# EAGLE schematic cell (EAGLE 6.5.0)
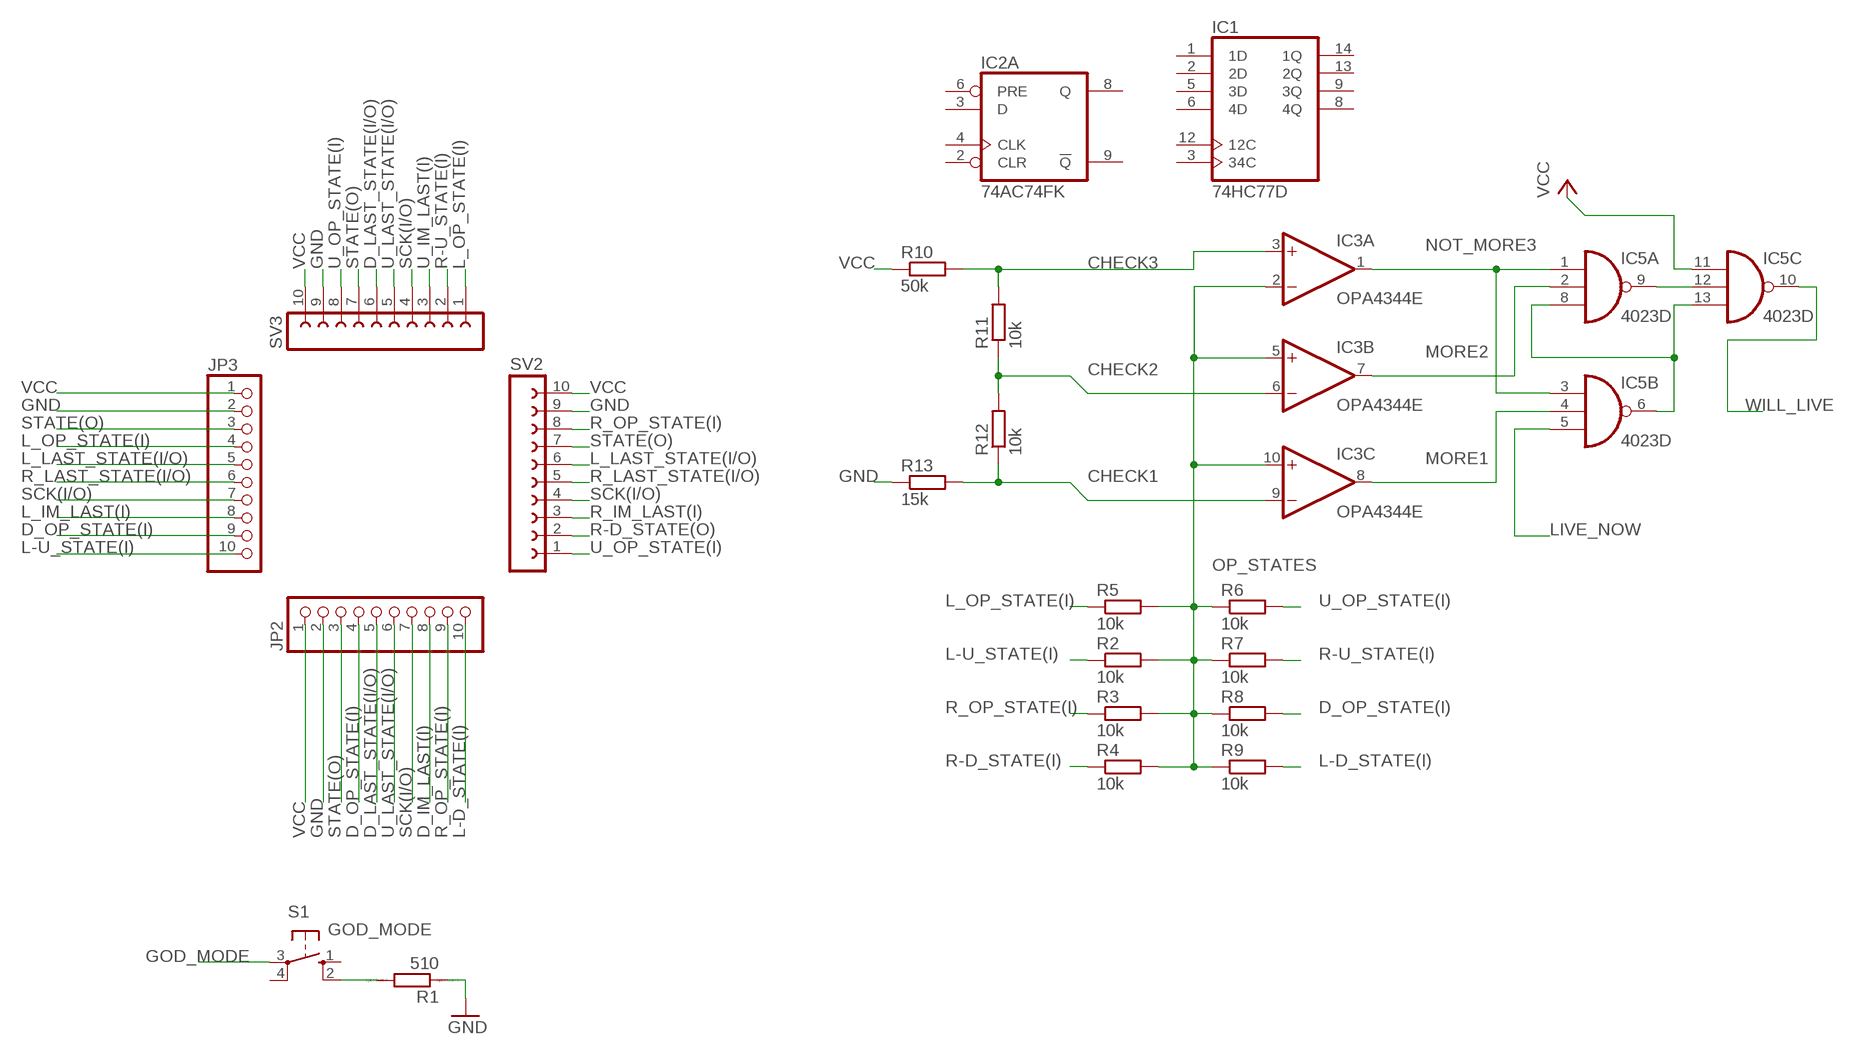
[diagram p0: schematic, sheet 1]

## Parts
IC1  74HC77D  [SO14]
IC2  74AC74FK  [LCC20]
IC3  OPA4344E  [TSSOP14]
IC5  4023D  [SO14]
JP2  PINHD-1X10  [1X10]
JP3  PINHD-1X10  [1X10]
R1  510  R  [R0805]
R2  10k  R-EU_R0805  [R0805]
R3  10k  R-EU_R0805  [R0805]
R4  10k  R-EU_R0805  [R0805]
R5  10k  R-EU_R0805  [R0805]
R6  10k  R-EU_R0805  [R0805]
R7  10k  R-EU_R0805  [R0805]
R8  10k  R-EU_R0805  [R0805]
R9  10k  R-EU_R0805  [R0805]
R10  50k  R-EU_R0805  [R0805]
R11  10k  R-EU_R0805  [R0805]
R12  10k  R-EU_R0805  [R0805]
R13  15k  R-EU_R0805  [R0805]
S1  GOD_MODE  10-XX  [B3F-10XX]
SV2  FE10W  [FE10W]
SV3  FE10W  [FE10W]

## Nets
CHECK1: IC3.9(C:-IN) R12.1 R13.2
CHECK2: IC3.6(B:-IN) R11.1 R12.2
CHECK3: IC3.3(A:+IN) R10.2 R11.2
D_IM_LAST(I): JP2.8
D_LAST_STATE(I/O): JP2.5 SV3.6
D_OP_STATE(I): JP2.4 JP3.9 R8.2
GND: JP2.2 JP3.2 R1.1 R13.1 SV2.9 SV3.9
GOD_MODE: S1.3(P)
L-D_STATE(I): JP2.10 R9.2
L-U_STATE(I): JP3.10 R2.1
L_IM_LAST(I): JP3.8
L_LAST_STATE(I/O): JP3.5 SV2.6
L_OP_STATE(I): JP3.4 R5.1 SV3.1
LIVE_NOW: IC5.5(B:I2)
MORE1: IC3.8(C:OUT) IC5.4(B:I1)
MORE2: IC3.7(B:OUT) IC5.2(A:I1)
N$1: R1.2 S1.2(S1)
N$2: IC5.6(B:O) IC5.8(A:I2) IC5.13(C:I2)
N$4: IC5.9(A:O) IC5.12(C:I1)
NOT_MORE3: IC3.1(A:OUT) IC5.1(A:I0) IC5.3(B:I0)
OP_STATES: IC3.2(A:-IN) IC3.5(B:+IN) IC3.10(C:+IN) R2.2 R3.2 R4.2 R5.2 R6.1 R7.1 R8.1 R9.1
R-D_STATE(I): R4.1
R-D_STATE(O): SV2.2
R-U_STATE(I): R7.2 SV3.2
R_IM_LAST(I): SV2.3
R_LAST_STATE(I/O): JP3.6 SV2.5
R_OP_STATE(I): JP2.9 R3.1 SV2.8
SCK(I/O): JP2.7 JP3.7 SV2.4 SV3.4
STATE(O): JP2.3 JP3.3 SV2.7 SV3.7
U_IM_LAST(I): SV3.3
U_LAST_STATE(I/O): JP2.6 SV3.5
U_OP_STATE(I): R6.2 SV2.1 SV3.8
VCC: IC5.11(C:I0) JP2.1 JP3.1 R10.1 SV2.10 SV3.10
WILL_LIVE: IC5.10(C:O)
Unconnected: IC1.1(1D) IC1.2(2D) IC1.3(34C) IC1.5(3D) IC1.6(4D) IC1.8(4Q) IC1.9(3Q) IC1.12(12C) IC1.13(2Q) IC1.14(1Q) IC2.2(A:CLR) IC2.3(A:D) IC2.4(A:CLK) IC2.6(A:PRE) IC2.8(A:Q) IC2.9(A:!Q) IC2.12(B:!Q) IC2.13(B:Q) IC2.14(B:PRE) IC2.16(B:CLK) IC2.18(B:D) IC2.19(B:CLR) IC3.12(D:+IN) IC3.13(D:-IN) IC3.14(D:OUT) S1.1(S) S1.4(P1)

## Power pins joined to a net without a drawn wire
GND: IC1.11(GND) IC2.10(P:GND)
V+: IC3.4(P:V+)
V-: IC3.11(P:V-)
VCC: IC1.4(VCC) IC2.20(P:VCC)
VDD: IC5.14(P:VDD)
VSS: IC5.7(P:VSS)

## Library data of the parts
IC1 = 74xx-eu:74*77: 4-bit D LATCH
IC2 = 74xx-eu:74*74: Dual D type positive edge triggered FLIP FLOP, preset and clear
IC3 = linear:OPA4*: Quad Operational Amplifier compatible with: TLC27L4 Low Power, Single-Supply, Rail-To-Rail Operational Amplifier Source: http://focus.ti.com/lit/ds/symlink/opa2345.pdf http://focus.ti.com .. opa241.pdf http://focus.ti.com .. tlc27l4.pdf http://focus.ti.com/lit/ds/symlink/opa2134.pdf
IC5 = 40xx:4023: Triple 3-input NAND
JP2 JP3 = pinhead:PINHD-1X10: PIN HEADER
R1 = eagle-ltspice:R: RESISTOR, European symbol; SPICEMODEL: NONE; SPICEPREFIX: R
R2-R13 = rcl:R-EU_: RESISTOR, European symbol
S1 = switch-omron:10-XX: OMRON SWITCH; MPN: B3F-1000; OC_FARNELL: 176432; OC_NEWARK: 36M3542
SV2 SV3 = con-lsta:FE10W: FEMALE HEADER; OC_FARNELL: unknown; OC_NEWARK: unknown